# EAGLE schematic micromouse_board_revB_V0.0.3 (EAGLE 9.4.0)
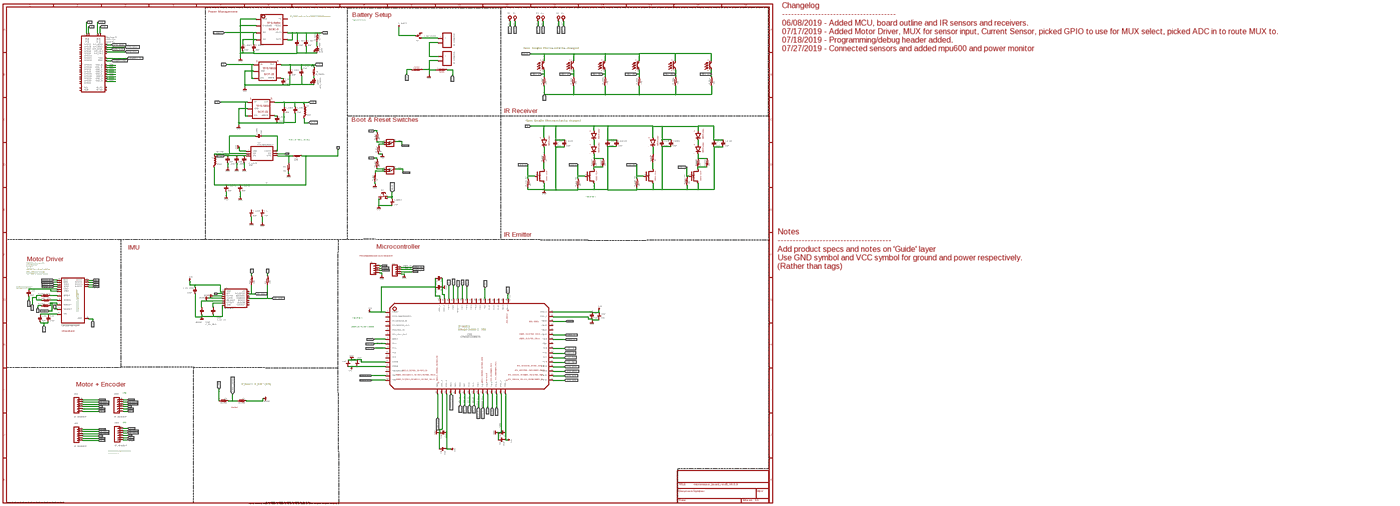
[diagram p0: schematic, sheet 1, overview]
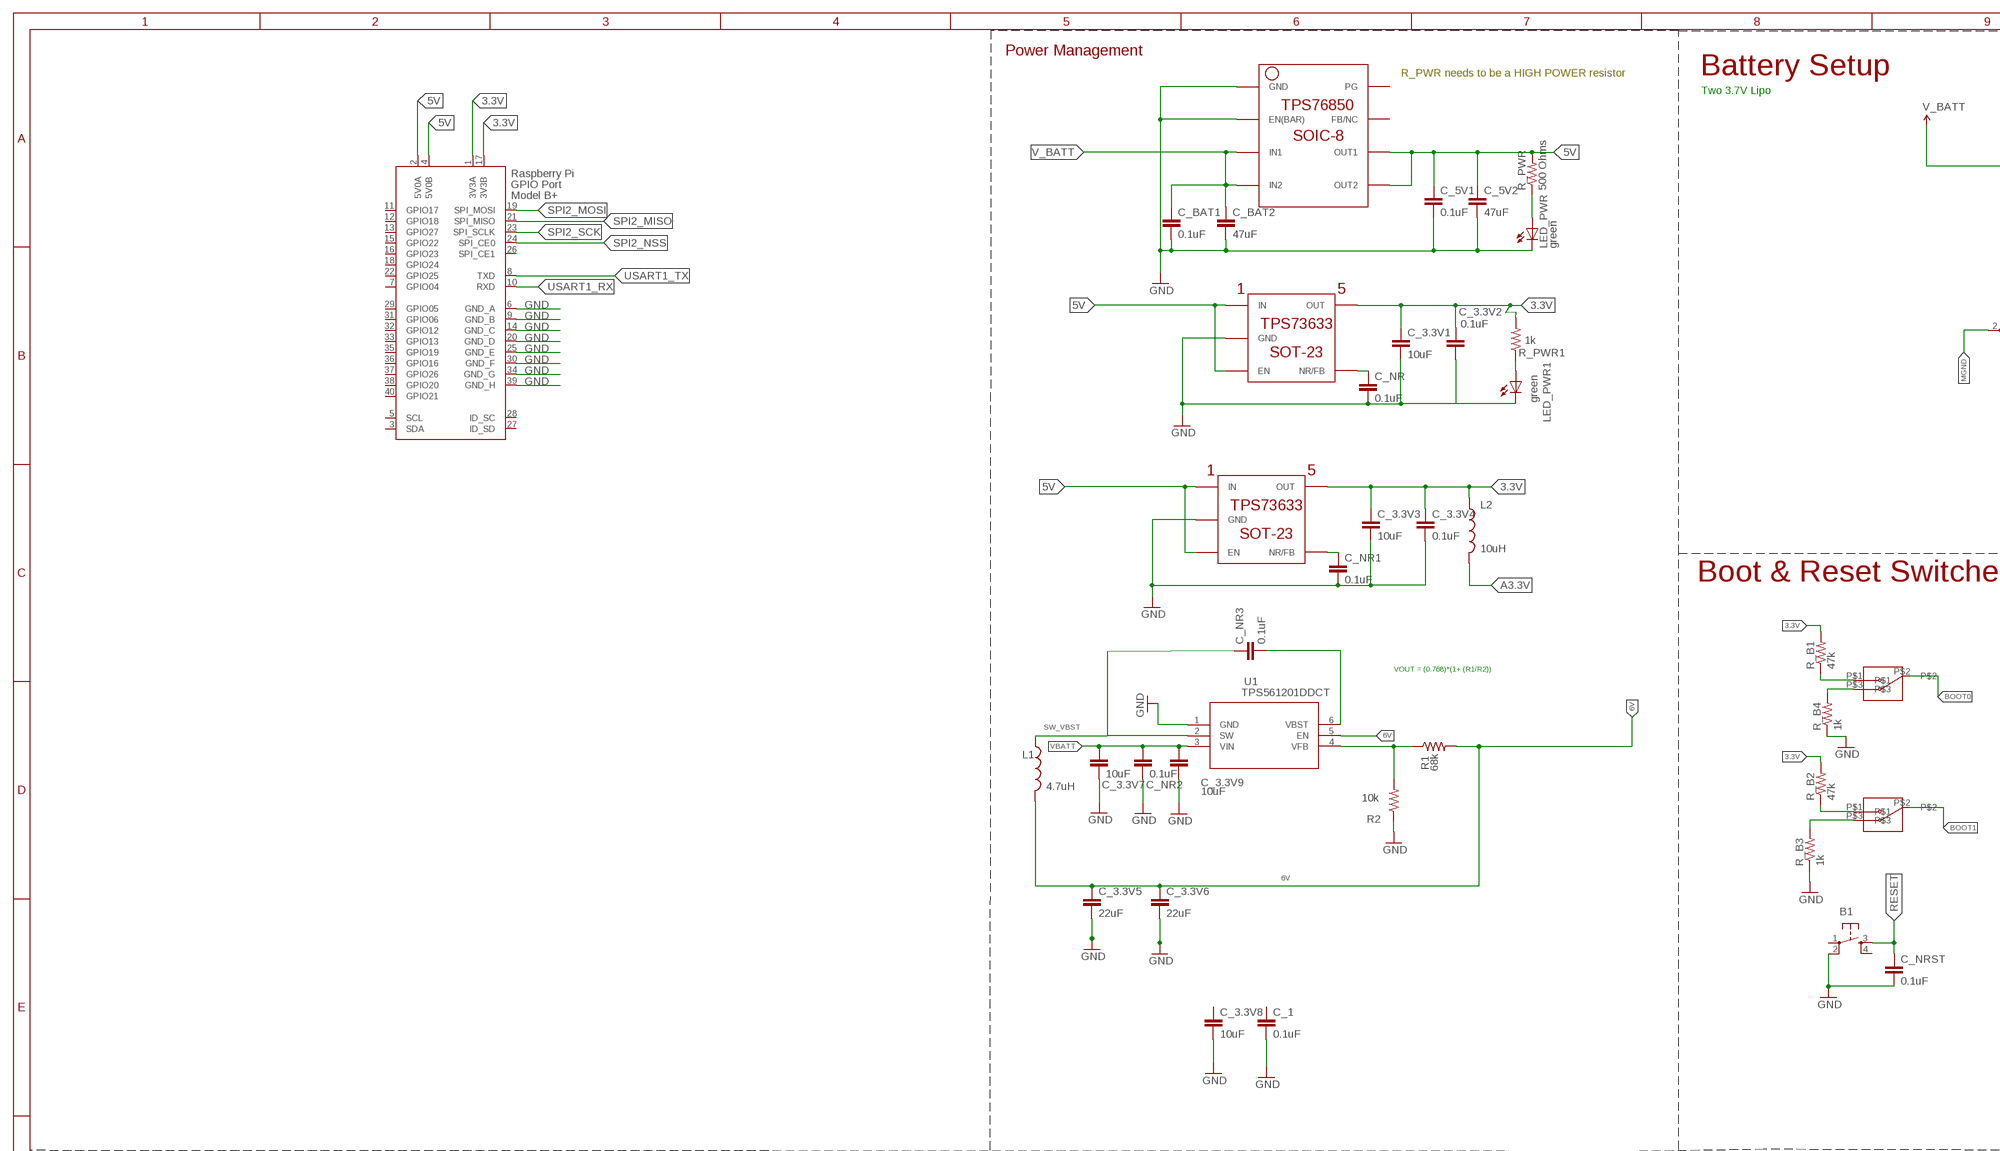
[diagram p1: schematic, sheet 1, part 1 of 6]
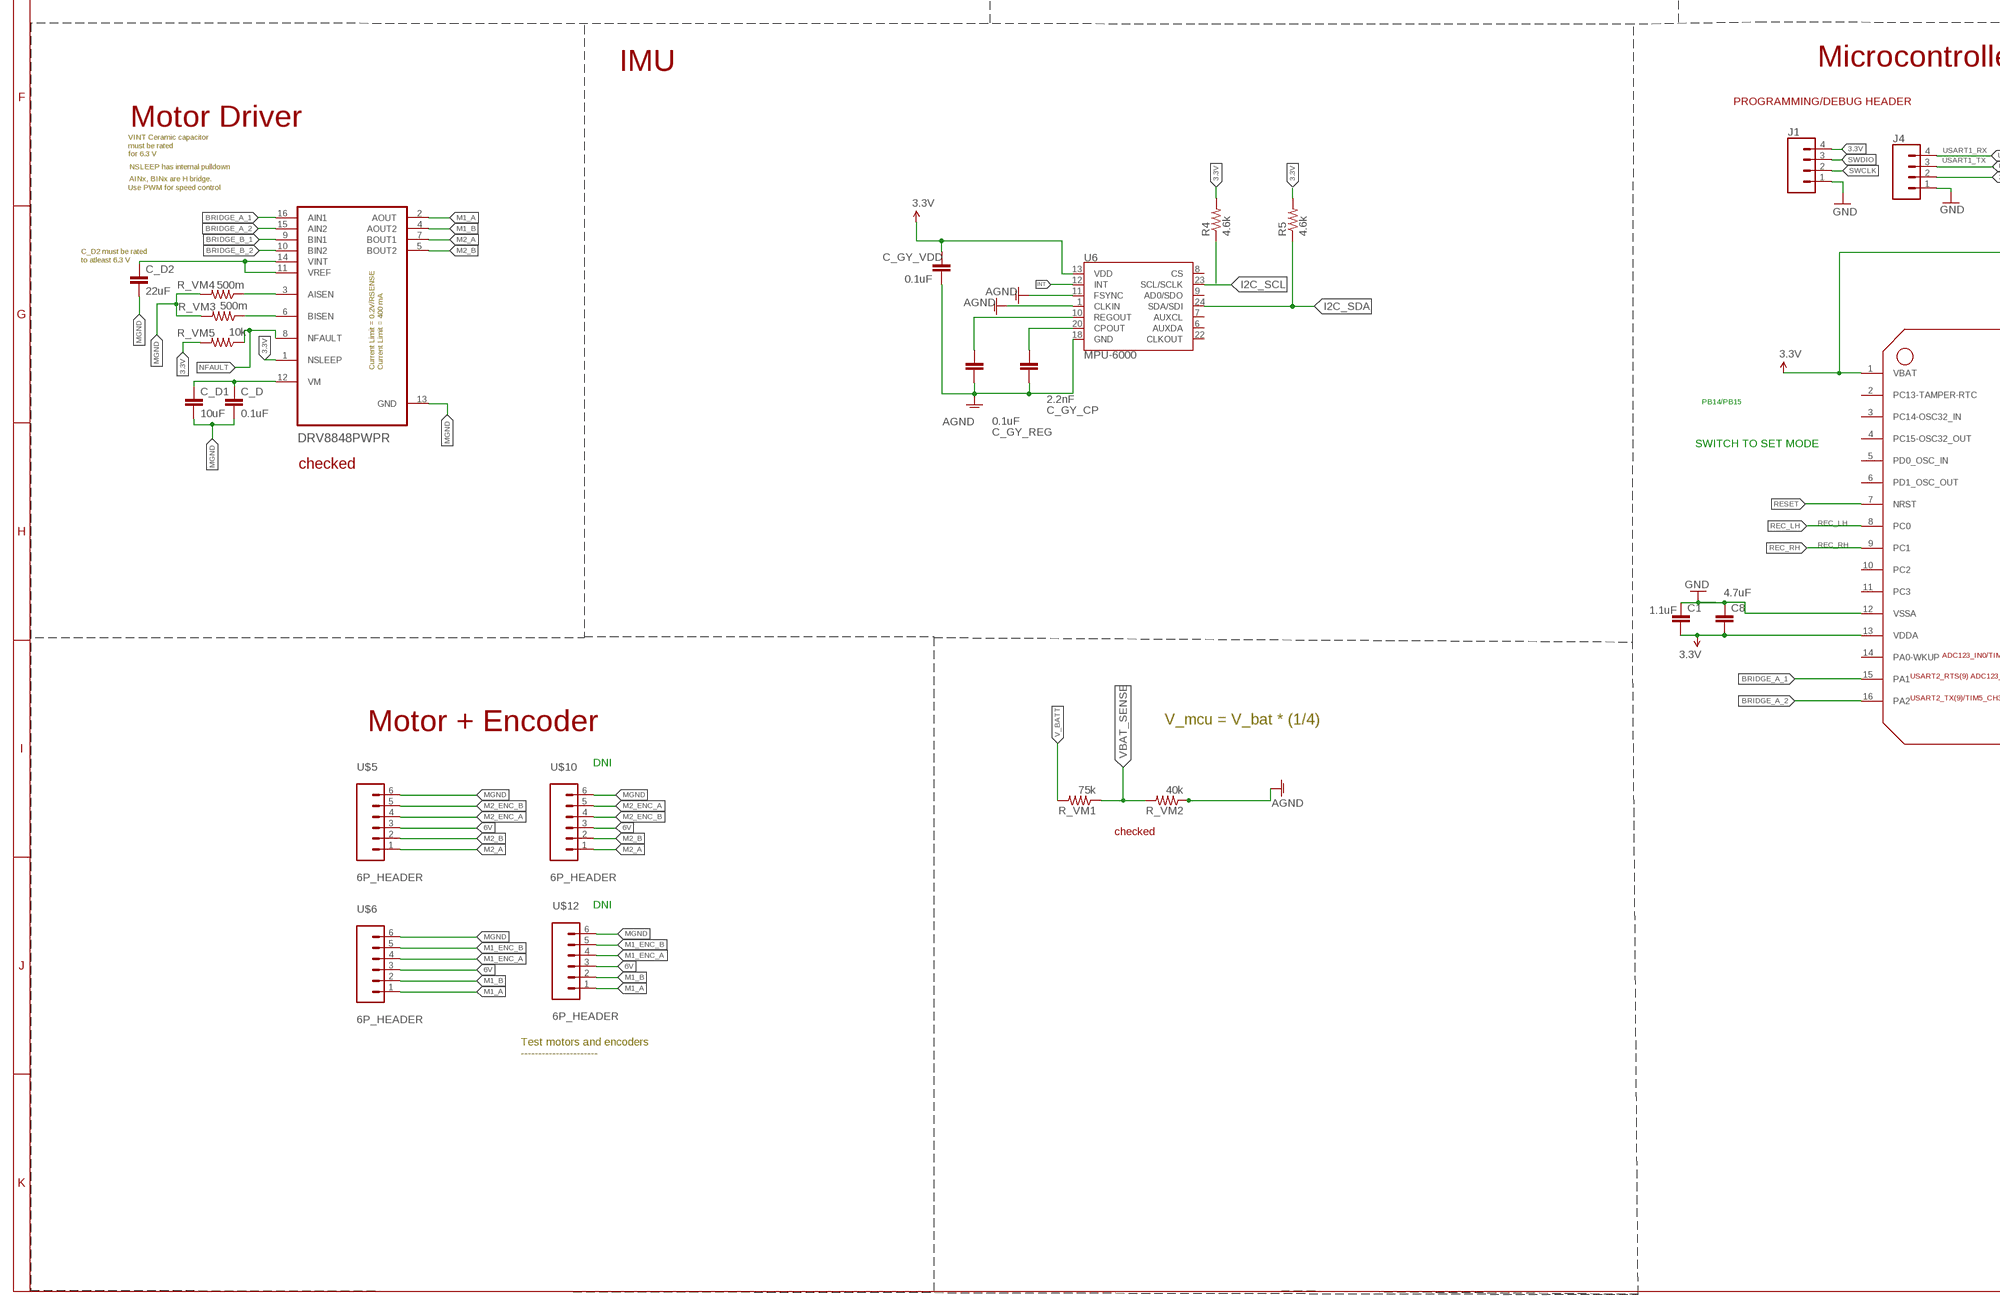
[diagram p2: schematic, sheet 1, part 2 of 6]
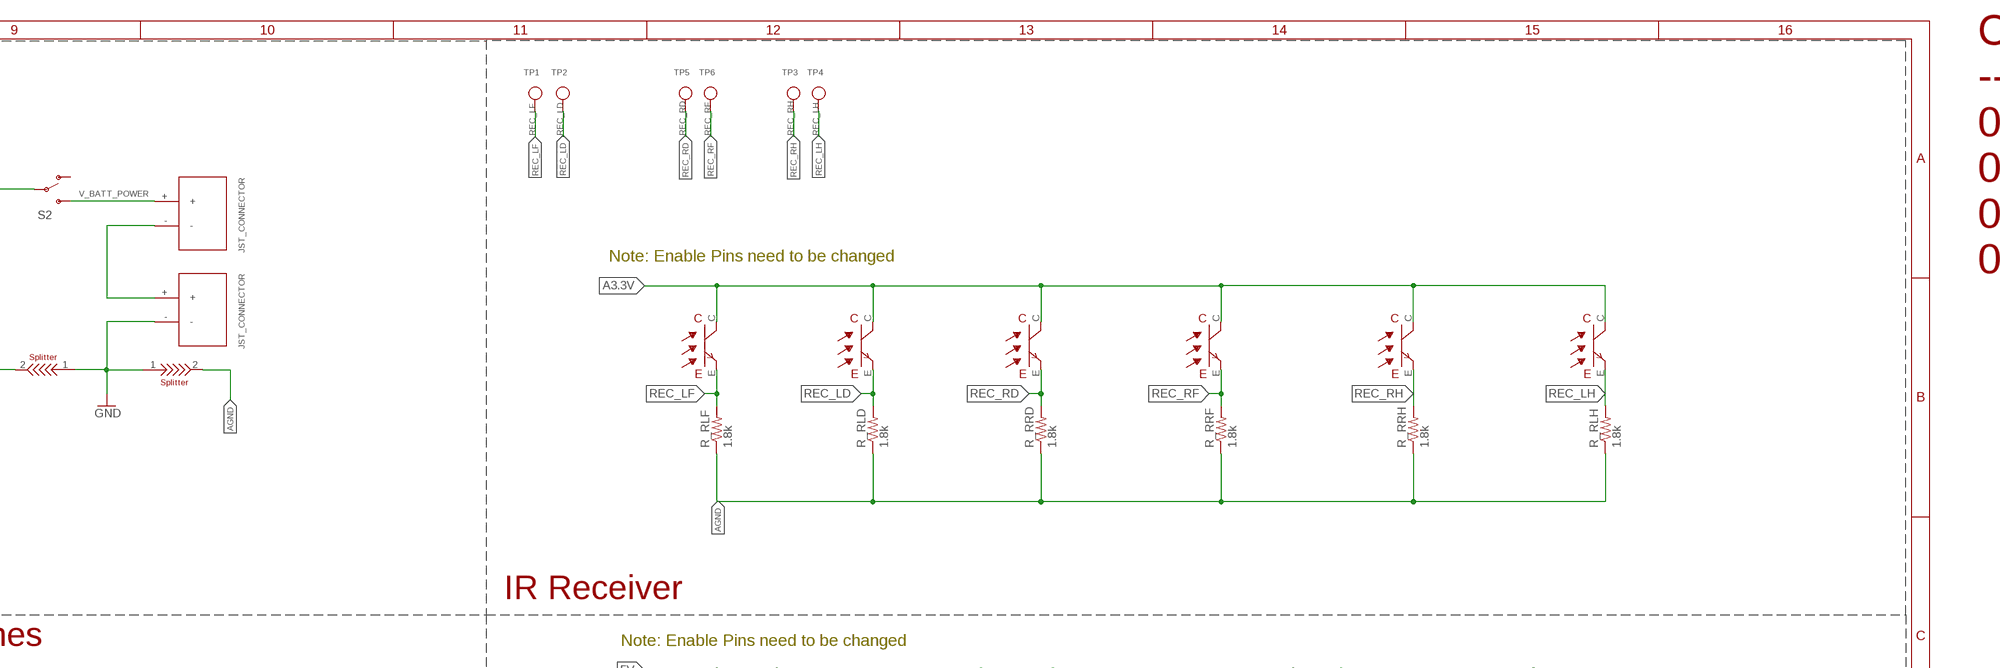
[diagram p3: schematic, sheet 1, part 3 of 6]
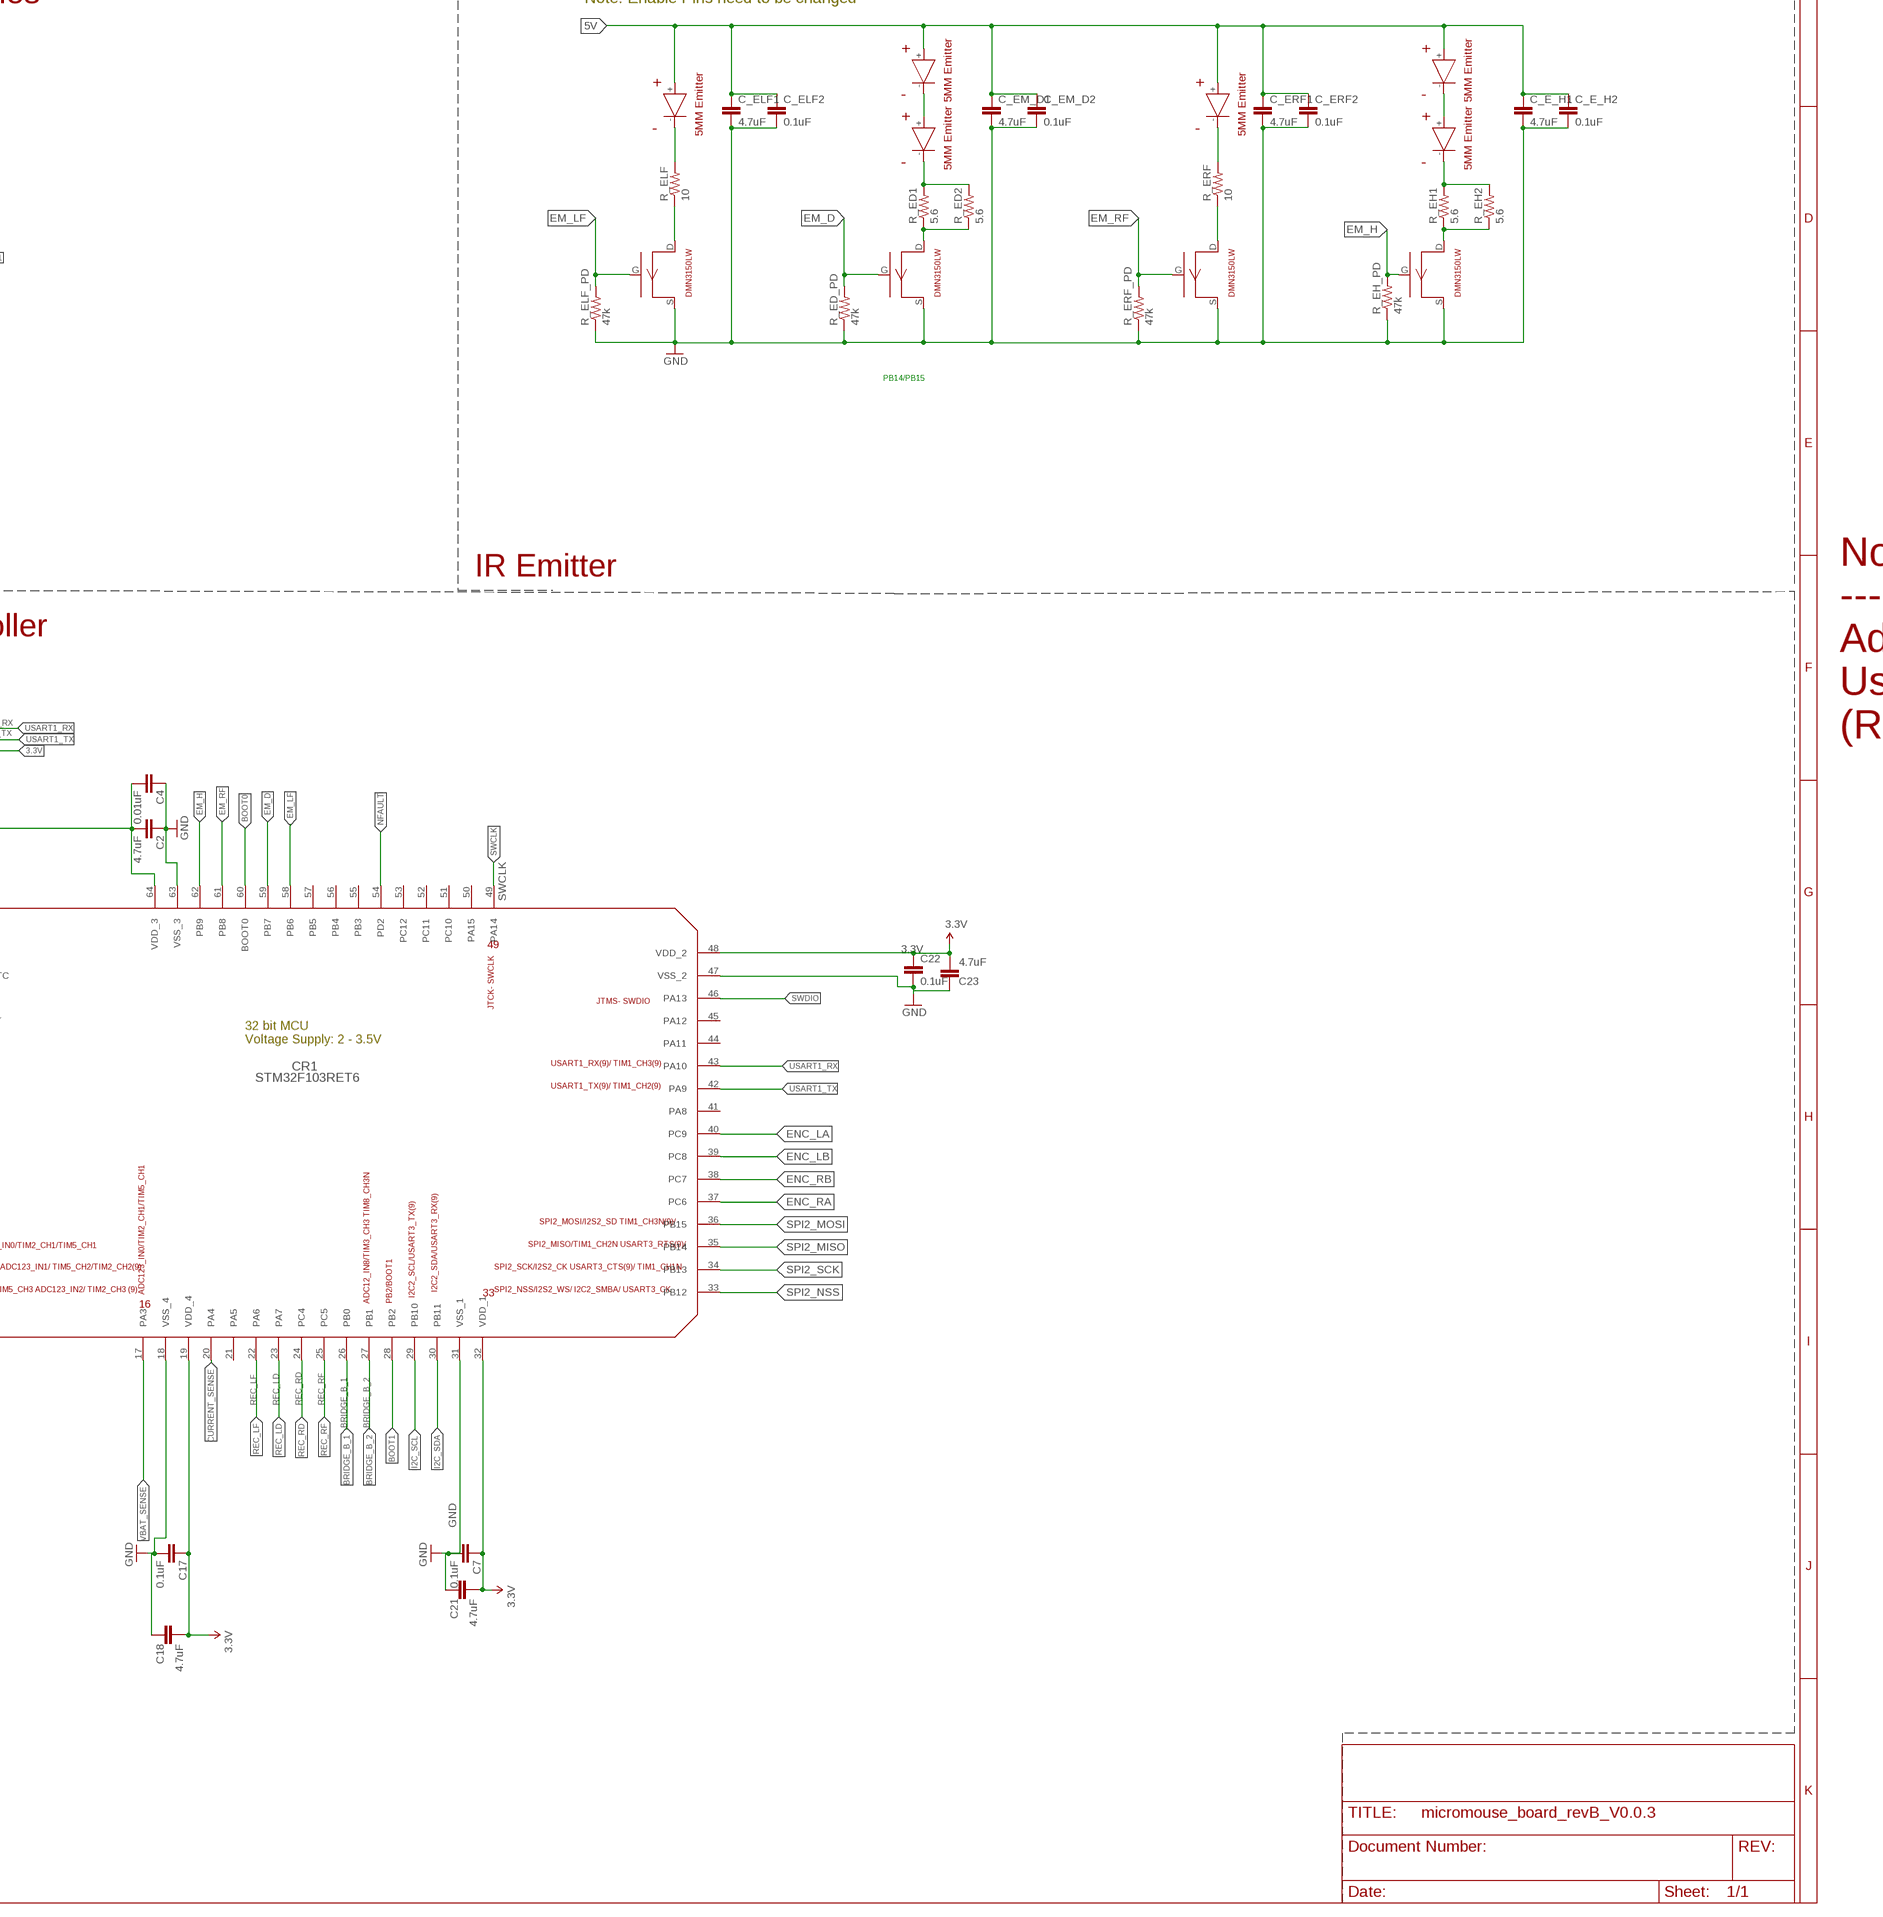
[diagram p4: schematic, sheet 1, part 4 of 6]
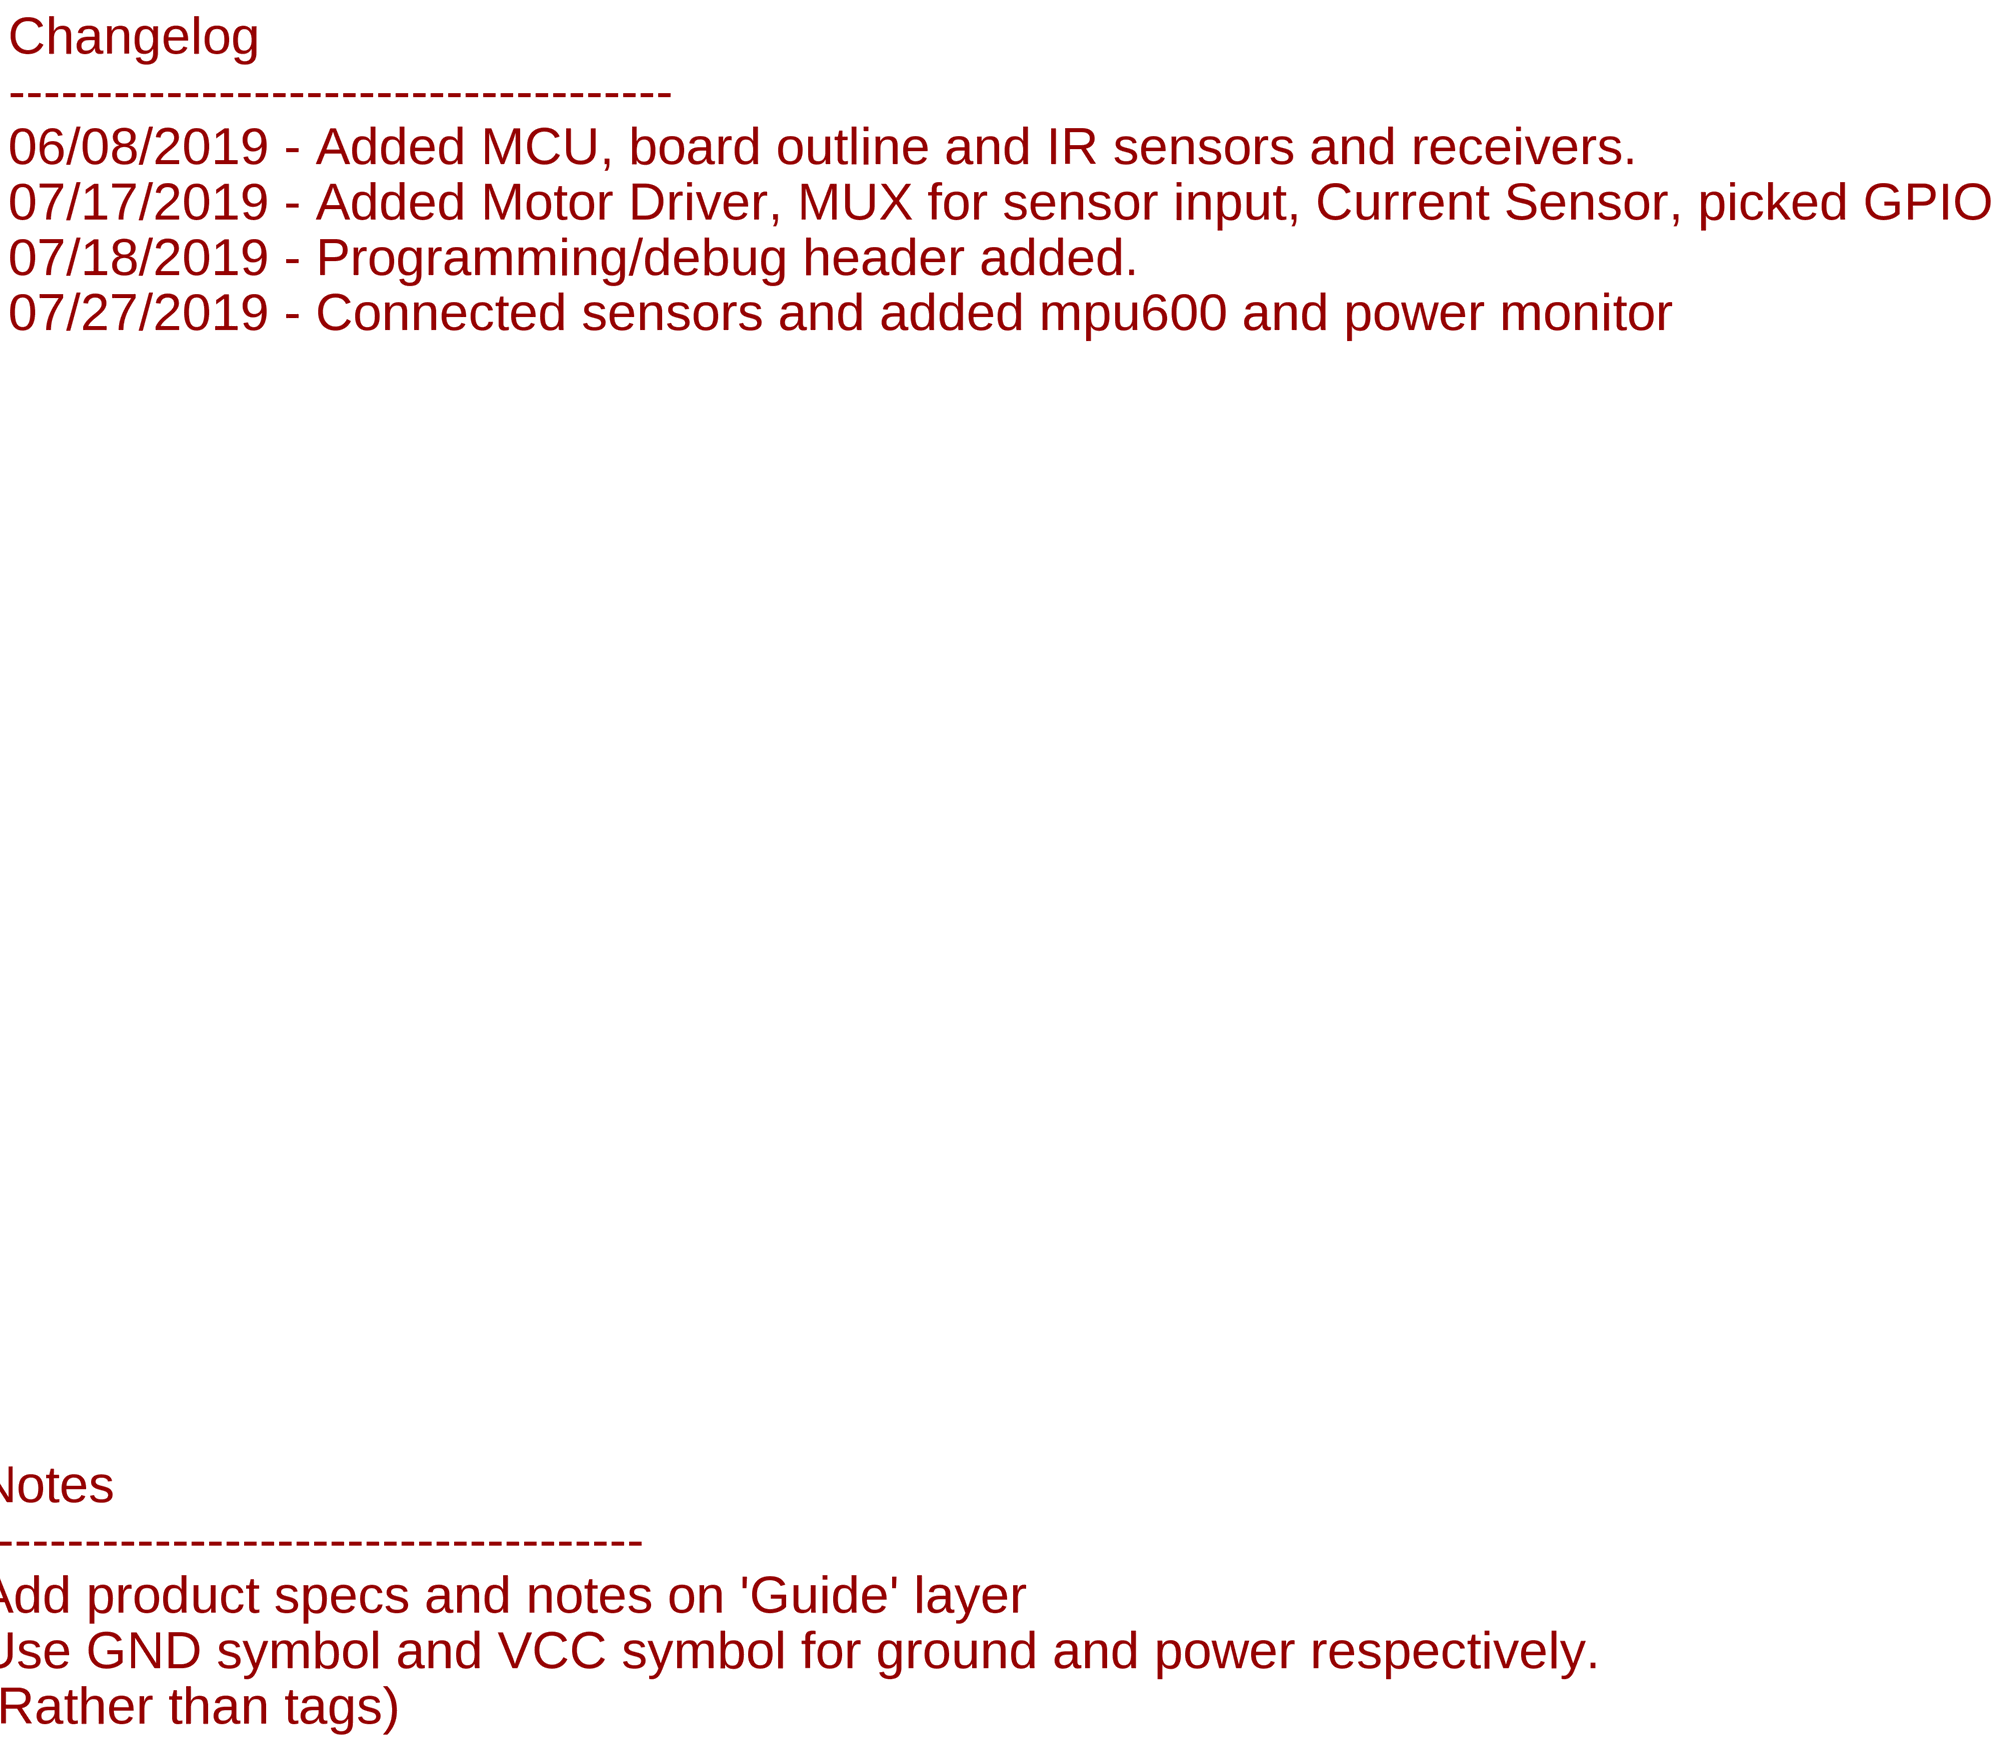
[diagram p5: schematic, sheet 1, part 5 of 6]
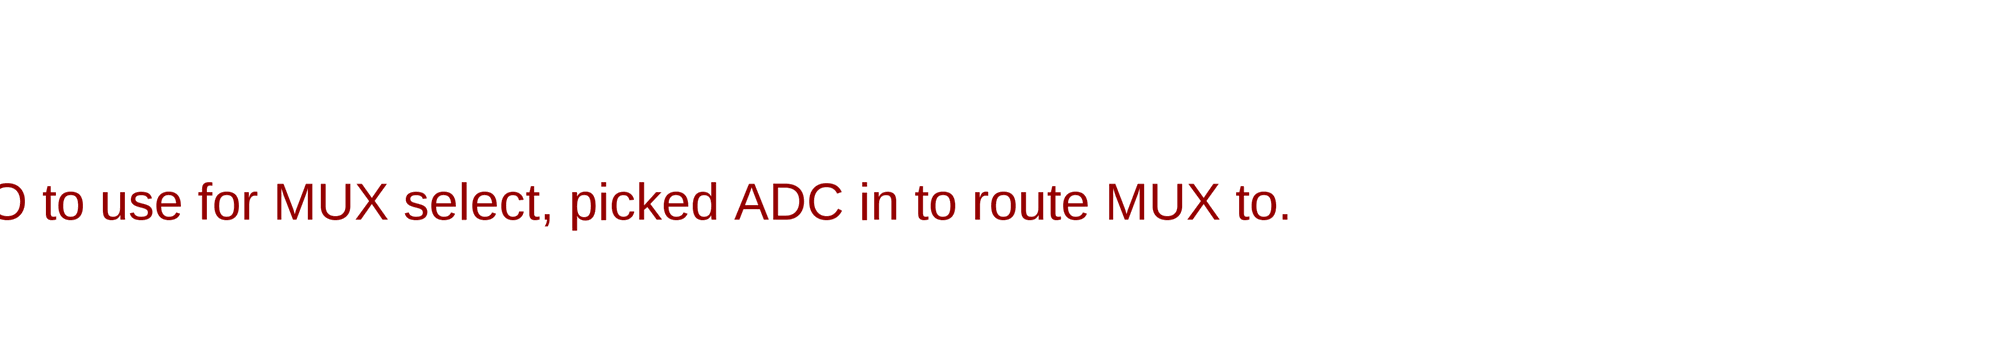
[diagram p6: schematic, sheet 1, part 6 of 6]

## Parts
B1  TAC_SWITCHSMD  [TACTILE-SWITCH-SMD]
C1  1.1uF  CAP0603-CAP  [0603-CAP]
C2  4.7uF  CAP0603-CAP  [0603-CAP]
C4  0.01uF  CAP0603-CAP  [0603-CAP]
C7  0.1uF  CAP0603-CAP  [0603-CAP]
C8  4.7uF  CAP0603-CAP  [0603-CAP]
C17  0.1uF  CAP0603-CAP  [0603-CAP]
C18  4.7uF  CAP0603-CAP  [0603-CAP]
C21  4.7uF  CAP0603-CAP  [0603-CAP]
C22  0.1uF  CAP0603-CAP  [0603-CAP]
C23  4.7uF  CAP0603-CAP  [0603-CAP]
C_1  0.1uF  CAP0603-CAP  [0603-CAP]
C_3.3V1  10uF  CAP0603-CAP  [0603-CAP]
C_3.3V2  0.1uF  CAP0603-CAP  [0603-CAP]
C_3.3V3  10uF  CAP0603-CAP  [0603-CAP]
C_3.3V4  0.1uF  CAP0603-CAP  [0603-CAP]
C_3.3V5  22uF  CAP0603-CAP  [0603-CAP]
C_3.3V6  22uF  CAP0603-CAP  [0603-CAP]
C_3.3V7  10uF  CAP0603-CAP  [0603-CAP]
C_3.3V8  10uF  CAP0603-CAP  [0603-CAP]
C_3.3V9  10uF  CAP0603-CAP  [0603-CAP]
C_5V1  0.1uF  CAP0603-CAP  [0603-CAP]
C_5V2  47uF  CAP1210  [1210]
C_BAT1  0.1uF  CAP0603-CAP  [0603-CAP]
C_BAT2  47uF  CAP1210  [1210]
C_D  0.1uF  CAP0603-CAP  [0603-CAP]
C_D1  10uF  CAP0603-CAP  [0603-CAP]
C_D2  22uF  CAP0603-CAP  [0603-CAP]
C_E_H1  4.7uF  CAP0603-CAP  [0603-CAP]
C_E_H2  0.1uF  CAP0603-CAP  [0603-CAP]
C_ELF1  4.7uF  CAP0603-CAP  [0603-CAP]
C_ELF2  0.1uF  CAP0603-CAP  [0603-CAP]
C_EM_D1  4.7uF  CAP0603-CAP  [0603-CAP]
C_EM_D2  0.1uF  CAP0603-CAP  [0603-CAP]
C_ERF1  4.7uF  CAP0603-CAP  [0603-CAP]
C_ERF2  0.1uF  CAP0603-CAP  [0603-CAP]
C_GY_CP  2.2nF  CAP0603-CAP  [0603-CAP]
C_GY_REG  0.1uF  CAP0603-CAP  [0603-CAP]
C_GY_VDD  0.1uF  CAP0603-CAP  [0603-CAP]
C_NR  0.1uF  CAP0603-CAP  [0603-CAP]
C_NR1  0.1uF  CAP0603-CAP  [0603-CAP]
C_NR2  0.1uF  CAP0603-CAP  [0603-CAP]
C_NR3  0.1uF  CAP0603-CAP  [0603-CAP]
C_NRST  0.1uF  CAP0603-CAP  [0603-CAP]
CR1  STM32F103RET6  [LQFP-64]
J1  CONN_04  [1X04]
J4  CONN_04  [1X04]
L1  4.7uH  INDUCTOR1007  [1007]
L2  10uH  INDUCTOR1007  [1007]
LED_PWR  green  LED1206  [LED-1206]
LED_PWR1  green  LED1206  [LED-1206]
LEFT_FRONT_EMITTER  EMITTER  [EMITTER]
NMOS1  DMN3150LW  [DMN3150LW]
NMOS2  DMN3150LW  [DMN3150LW]
NMOS3  DMN3150LW  [DMN3150LW]
NMOS4  DMN3150LW  [DMN3150LW]
R1  68k  RESISTOR0603-RES  [0603-RES]
R2  10k  RESISTOR0603-RES  [0603-RES]
R4  4.6k  R-US_M0805  [M0805]
R5  4.6k  R-US_M0805  [M0805]
R_B1  47k  RESISTOR0603-RES  [0603-RES]
R_B2  47k  RESISTOR0603-RES  [0603-RES]
R_B3  1k  RESISTOR0603-RES  [0603-RES]
R_B4  1k  RESISTOR0603-RES  [0603-RES]
R_ED1  5.6  RESISTOR0603-RES  [0603-RES]
R_ED2  5.6  RESISTOR0603-RES  [0603-RES]
R_ED_PD  47k  RESISTOR0603-RES  [0603-RES]
R_EH1  5.6  RESISTOR0603-RES  [0603-RES]
R_EH2  5.6  RESISTOR0603-RES  [0603-RES]
R_EH_PD  47k  RESISTOR0603-RES  [0603-RES]
R_ELF  10  RESISTOR0603-RES  [0603-RES]
R_ELF_PD  47k  RESISTOR0603-RES  [0603-RES]
R_ERF  10  RESISTOR0603-RES  [0603-RES]
R_ERF_PD  47k  RESISTOR0603-RES  [0603-RES]
R_PWR  500 Ohms  RESISTOR0603-RES  [0603-RES]
R_PWR1  1k  RESISTOR0603-RES  [0603-RES]
R_RLD  1.8k  RESISTOR0603-RES  [0603-RES]
R_RLF  1.8k  RESISTOR0603-RES  [0603-RES]
R_RLH  1.8k  RESISTOR0603-RES  [0603-RES]
R_RRD  1.8k  RESISTOR0603-RES  [0603-RES]
R_RRF  1.8k  RESISTOR0603-RES  [0603-RES]
R_RRH  1.8k  RESISTOR0603-RES  [0603-RES]
R_VM1  75k  RESISTOR0603-RES  [0603-RES]
R_VM2  40k  RESISTOR0603-RES  [0603-RES]
R_VM3  500m  RESISTOR0603-RES  [0603-RES]
R_VM4  500m  RESISTOR0603-RES  [0603-RES]
R_VM5  10k  RESISTOR0603-RES  [0603-RES]
REC_LF  RECEIVER  [RECEIVER]
S2  SWITCH-SPSTPTH  [SWITCH-SPDT]
TP1  TESTPOINTROUND2MM  [TESTPOINT_ROUND_2MM]
TP2  TESTPOINTROUND2MM  [TESTPOINT_ROUND_2MM]
TP3  TESTPOINTROUND2MM  [TESTPOINT_ROUND_2MM]
TP4  TESTPOINTROUND2MM  [TESTPOINT_ROUND_2MM]
TP5  TESTPOINTROUND2MM  [TESTPOINT_ROUND_2MM]
TP6  TESTPOINTROUND2MM  [TESTPOINT_ROUND_2MM]
U1  TPS561201DDCT  [DDC6]
U2  DRV8848PWPR  [SOP65P640X120-17N]
U6  MPU-6000  [QFN-24-EP]
U$1  JST_CONNECTOR_FEMALE  [JST_CONNECTOR_FEMALE]
U$2  JST_CONNECTOR_FEMALE  [JST_CONNECTOR_FEMALE]
U$3  TPS73633(SOT-23)  [TPS73633(SOT-23)]
U$4  TPS76850(SOIC-8)  [TPS76850(SOIC-8)]
U$5  6P_HEADER  [6P_HEADER]
U$6  6P_HEADER  [6P_HEADER]
U$7  RECEIVER  [RECEIVER]
U$8  RECEIVER  [RECEIVER]
U$9  RECEIVER  [RECEIVER]
U$10  6P_HEADER  [6P_HEADER]
U$11  EMITTER  [EMITTER]
U$12  6P_HEADER  [6P_HEADER]
U$13  EMITTER  [EMITTER]
U$14  SPARKFUN-SPDT  [SPDT]
U$15  SPARKFUN-SPDT  [SPDT]
U$16  SPLITTER  [SPLITTER]
U$17  EMITTER  [EMITTER]
U$18  EMITTER  [EMITTER]
U$19  EMITTER  [EMITTER]
U$20  RECEIVER  [RECEIVER]
U$21  RECEIVER  [RECEIVER]
U$22  SPLITTER  [SPLITTER]
U$23  TPS73633(SOT-23)  [TPS73633(SOT-23)]
X1  RASPI_GPIO_B+#_PIN  [RASPI_GPIO_B+_PIN]

## Nets
3.3V: C1.2 C2.2 C4.2 C7.1 C8.2 C17.1 C18.2 C21.2 C22.1 C23.2 C_3.3V1.1 C_3.3V2.1 C_3.3V3.1 C_3.3V4.1 C_GY_VDD.1 CR1.1(VBAT) CR1.13(VDDA) CR1.19(VDD_4) CR1.32(VDD_1) CR1.48(VDD_2) CR1.64(VDD_3) J1.4 J4.2 L2.1 R4.2 R5.2 R_B1.2 R_B2.2 R_PWR1.2 R_VM5.2 U2.1(NSLEEP) U6.13(VDD) U$3.OUT U$23.OUT X1.1(3V3A) X1.17(3V3B)
5V: C_5V1.1 C_5V2.1 C_E_H1.1 C_E_H2.1 C_ELF1.1 C_ELF2.1 C_EM_D1.1 C_EM_D2.1 C_ERF1.1 C_ERF2.1 LEFT_FRONT_EMITTER.+ R_PWR.2 U$3.EN U$3.IN U$4.OUT1 U$4.OUT2 U$11.+ U$13.+ U$18.+ U$23.EN U$23.IN X1.2(5V0A) X1.4(5V0B)
6V: C_3.3V5.1 C_3.3V6.1 L1.2 R1.2 U1.5(EN) U$5.3 U$6.3 U$10.3 U$12.3
A3.3V: L2.2 REC_LF.C U$7.C U$8.C U$9.C U$20.C U$21.C
AGND: C_GY_CP.2 C_GY_REG.2 C_GY_VDD.2 R_RLD.1 R_RLF.1 R_RLH.1 R_RRD.1 R_RRF.1 R_RRH.1 R_VM2.1 U6.1(CLKIN) U6.11(FSYNC) U6.18(GND) U$22.2
BATT_CONN: U$1.+ U$2.-
BOOT0: CR1.60(BOOT0) U$14.P$2
BOOT1: CR1.28(PB2) U$15.P$2
BRIDGE_A_1: CR1.15(PA1) U2.16(AIN1)
BRIDGE_A_2: CR1.16(PA2) U2.15(AIN2)
BRIDGE_B_1: CR1.26(PB0) U2.9(BIN1)
BRIDGE_B_2: CR1.27(PB1) U2.10(BIN2)
CURRENT_SENSE: CR1.20(PA4)
D2_EM: R_ED1.2 R_ED2.2 U$17.-
D_EM: U$11.- U$17.+
EM_D: CR1.59(PB7) NMOS2.G R_ED_PD.2
EM_H: CR1.62(PB9) NMOS4.G R_EH_PD.2
EM_LF: CR1.58(PB6) NMOS1.G R_ELF_PD.2
EM_RF: CR1.61(PB8) NMOS3.G R_ERF_PD.2
ENC_LA: CR1.40(PC9)
ENC_LB: CR1.39(PC8)
ENC_RA: CR1.37(PC6)
ENC_RB: CR1.38(PC7)
GND: B1.2 C1.1 C2.1 C4.1 C7.2 C8.1 C17.2 C18.1 C21.1 C22.2 C23.1 C_1.2 C_3.3V1.2 C_3.3V2.2 C_3.3V3.2 C_3.3V4.2 C_3.3V5.2 C_3.3V6.2 C_3.3V7.2 C_3.3V8.2 C_3.3V9.2 C_5V1.2 C_5V2.2 C_BAT1.2 C_BAT2.2 C_E_H1.2 C_E_H2.2 C_ELF1.2 C_ELF2.2 C_EM_D1.2 C_EM_D2.2 C_ERF1.2 C_ERF2.2 C_NR1.2 C_NR2.2 C_NR.2 C_NRST.2 CR1.12(VSSA) CR1.18(VSS_4) CR1.31(VSS_1) CR1.47(VSS_2) CR1.63(VSS_3) J1.1 J4.1 LED_PWR1.C LED_PWR.C NMOS1.S NMOS2.S NMOS3.S NMOS4.S R2.1 R_B3.1 R_B4.1 R_ED_PD.1 R_EH_PD.1 R_ELF_PD.1 R_ERF_PD.1 U1.1(GND) U$1.- U$3.GND U$4.EN(BAR) U$4.GND U$16.1 U$22.1 U$23.GND X1.6(GND_A) X1.9(GND_B) X1.14(GND_C) X1.20(GND_D) X1.25(GND_E) X1.30(GND_F) X1.34(GND_G) X1.39(GND_H)
H2_EM: R_EH1.2 R_EH2.2 U$19.-
H_EM: U$18.- U$19.+
I2C_SCL: CR1.29(PB10) U6.23(SCL/SCLK)
I2C_SDA: CR1.30(PB11) R5.1 U6.24(SDA/SDI)
INT: U6.12(INT)
LF_EM: LEFT_FRONT_EMITTER.- R_ELF.2
M1_A: U2.2(AOUT) U$6.1 U$12.1
M1_B: U2.4(AOUT2) U$6.2 U$12.2
M1_ENC_A: U$6.4 U$12.4
M1_ENC_B: U$6.5 U$12.5
M2_A: U2.7(BOUT1) U$5.1 U$10.1
M2_B: U2.5(BOUT2) U$5.2 U$10.2
M2_ENC_A: U$5.4 U$10.5
M2_ENC_B: U$5.5 U$10.4
MGND: C_D1.2 C_D2.2 C_D.2 R_VM3.2 R_VM4.2 U2.13(GND) U$5.6 U$6.6 U$10.6 U$12.6 U$16.2
N$1: C_NR1.1 U$23.NR/FB
N$2: R_VM4.1 U2.3(AISEN)
N$3: R4.1
N$4: R_B2.1 U$15.P$1
N$5: NMOS3.D R_ERF.1
N$6: R_B1.1 U$14.P$1
N$7: NMOS1.D R_ELF.1
N$8: R_VM3.1 U2.6(BISEN)
N$9: LED_PWR1.A R_PWR1.1
N$10: C_D1.1 C_D.1 U2.12(VM)
N$11: C_D2.1 U2.11(VREF) U2.14(VINT)
N$12: R_B3.2 U$15.P$3
N$13: R_B4.2 U$14.P$3
N$14: R1.1 R2.2 U1.4(VFB)
N$15: C_NR3.2 U1.6(VBST)
N$18: NMOS2.D R_ED1.1 R_ED2.1
N$19: NMOS4.D R_EH1.1 R_EH2.1
N$26: C_NR.1 U$3.NR/FB
N$27: LED_PWR.A R_PWR.1
N$28: C_GY_REG.1 U6.10(REGOUT)
N$29: C_GY_CP.1 U6.20(CPOUT)
NFAULT: CR1.54(PD2) R_VM5.1 U2.8(NFAULT)
REC_LD: CR1.23(PA7) R_RLD.2 TP2.P$1 U$7.E
REC_LF: CR1.22(PA6) R_RLF.2 REC_LF.E TP1.P$1
REC_LH: CR1.8(PC0) R_RLH.2 TP4.P$1 U$21.E
REC_RD: CR1.24(PC4) R_RRD.2 TP5.P$1 U$8.E
REC_RF: CR1.25(PC5) R_RRF.2 TP6.P$1 U$9.E
REC_RH: CR1.9(PC1) R_RRH.2 TP3.P$1 U$20.E
RESET: B1.3 C_NRST.1 CR1.7(NRST)
RF_EM: R_ERF.2 U$13.-
SPI2_MISO: CR1.35(PB14) X1.21(SPI_MISO)
SPI2_MOSI: CR1.36(PB15) X1.19(SPI_MOSI)
SPI2_NSS: CR1.33(PB12) X1.24(SPI_CE0)
SPI2_SCK: CR1.34(PB13) X1.23(SPI_SCLK)
SW_VBST: C_NR3.1 L1.1 U1.2(SW)
SWCLK: CR1.49(PA14) J1.2
SWDIO: CR1.46(PA13) J1.3
USART1_RX: CR1.43(PA10) J4.4 X1.10(RXD)
USART1_TX: CR1.42(PA9) J4.3 X1.8(TXD)
V_BATT: C_BAT1.1 C_BAT2.1 R_VM1.2 S2.2(P) U$4.IN1 U$4.IN2
V_BATT_POWER: S2.3(S) U$2.+
VBAT_SENSE: CR1.17(PA3) R_VM1.1 R_VM2.2
VBATT: C_3.3V7.1 C_3.3V9.1 C_NR2.1 U1.3(VIN)
Unconnected: B1.1 B1.4 C_1.1 C_3.3V8.1 CR1.2(PC13-TAMPER-RTC) CR1.3(PC14-OSC32_IN) CR1.4(PC15-OSC32_OUT) CR1.5(PD0_OSC_IN) CR1.6(PD1_OSC_OUT) CR1.10(PC2) CR1.11(PC3) CR1.14(PA0-WKUP) CR1.21(PA5) CR1.41(PA8) CR1.44(PA11) CR1.45(PA12) CR1.50(PA15) CR1.51(PC10) CR1.52(PC11) CR1.53(PC12) CR1.55(PB3) CR1.56(PB4) CR1.57(PB5) S2.1(O) U6.6(AUXDA) U6.7(AUXCL) U6.8(CS) U6.9(AD0/SDO) U6.22(CLKOUT) U$4.FB/NC U$4.PG X1.3(SDA) X1.5(SCL) X1.7(GPIO04) X1.11(GPIO17) X1.12(GPIO18) X1.13(GPIO27) X1.15(GPIO22) X1.16(GPIO23) X1.18(GPIO24) X1.22(GPIO25) X1.26(SPI_CE1) X1.27(ID_SD) X1.28(ID_SC) X1.29(GPIO05) X1.31(GPIO06) X1.32(GPIO12) X1.33(GPIO13) X1.35(GPIO19) X1.36(GPIO16) X1.37(GPIO26) X1.38(GPIO20) X1.40(GPIO21)

## Notes on the sheet
- Power Management
- R_PWR needs to be a HIGH POWER resistor | Battery Setup
- Two 3.7V Lipo
- Note: Enable Pins need to be changed
- Changelog
  --------------------------------------
  06/08/2019 - Added MCU, board outline and IR sensors and receivers.                                      
  07/17/2019 - Added Motor Driver, MUX for sensor input, Current Sensor, picked GPIO to use for MUX select, picked ADC in to route MUX to. 
  07/18/2019 - Programming/debug header added.
  07/27/2019 - Connected sensors and added mpu600 and power monitor
- IR Receiver
- Boot & Reset Switches | Note: Enable Pins need to be changed
- VOUT = (0.768)*(1+ (R1/R2))
- PB14/PB15
- IR Emitter
- IMU | Microcontroller
- PROGRAMMING/DEBUG HEADER
- Motor Driver
- VINT Ceramic capacitor 
  must be rated 
  for 6.3 V
- Notes
  --------------------------------------
  Add product specs and notes on 'Guide' layer
  Use GND symbol and VCC symbol for ground and power respectively.
  (Rather than tags)
- NSLEEP has internal pulldown
- AINx, BINx are H bridge.
- Use PWM for speed control
- C_D2 must be rated
  to atleast 6.3 V
- Current Limit = 0.2V/RSENSE
  Current Limit = 400 mA
- PB14/PB15
- JTMS- SWDIO
- JTCK- SWCLK
- SWITCH TO SET MODE
- 32 bit MCU
  Voltage Supply: 2 - 3.5V
- checked
- USART1_RX(9)/ TIM1_CH3(9)
- USART1_TX(9)/ TIM1_CH2(9)
- SPI2_MOSI/I2S2_SD TIM1_CH3N(9)/
- ADC123_IN0/TIM2_CH1/TIM5_CH1 | SPI2_MISO/TIM1_CH2N USART3_RTS(9)/
- USART2_RTS(9) ADC123_IN1/ TIM5_CH2/TIM2_CH2(9) | SPI2_SCK/I2S2_CK USART3_CTS(9)/ TIM1_CH1N
- USART2_TX(9)/TIM5_CH3 ADC123_IN2/ TIM2_CH3 (9) | ADC123_IN0/TIM2_CH1/TIM5_CH1 | I2C2_SDA/USART3_RX(9) | SPI2_NSS/I2S2_WS/ I2C2_SMBA/ USART3_CK
- I2C2_SCL/USART3_TX(9)
- ADC12_IN8/TIM3_CH3 TIM8_CH3N | PB2/BOOT1
- V_mcu = V_bat * (1/4)
- Motor + Encoder
- DNI
- checked
- DNI
- Test motors and encoders
  ----------------------

## Library data of the parts
B1 = SparkFun-Retired:TAC_SWITCH: Momentary Switch Button commonly used for reset or general input. Spark Fun Electronics SKU : COM-00097 SMT- SWCH-08247; PROD_ID: SWCH-08247; VALUE: TAC_SWITCHSMD
C1 C2 C4 C7 C8 C17 C18 C21-C23 C_1 C_3.3V1-C_3.3V9 C_5V1 C_5V2 C_BAT1 C_BAT2 C_D C_D1 C_D2 C_E_H1 C_E_H2 C_ELF1 C_ELF2 C_EM_D1 C_EM_D2 C_ERF1 C_ERF2 C_GY_CP C_GY_REG C_GY_VDD C_NR C_NR1-C_NR3 = micromouse-board-added-piconnector:CAP: Capacitor Standard 0603 ceramic capacitor, and 0.1" leaded capacitor.
C_NRST = SparkFun:CAP: Capacitor Standard 0603 ceramic capacitor, and 0.1" leaded capacitor.
CR1 = micromouse-board-added-piconnector:STM32F103RET6; MANUFACTURER_PART_NUMBER: STM32F103RET6; VENDOR: STMicroelectronics
J1 J4 = micromouse-board-added-piconnector:CONN_04: Multi connection point. Often used as Generic Header-pin footprint for 0.1 inch spaced/style header connections On any of the 0.1 inch spaced packages, you can populate with these: Break Away Headers - Straight <https://www.sparkfun.com/products/116> (PRT-00116) Break Away Male Headers - Right Angle <https://www.sparkfun.com/products/553> (PRT-00553) Female Headers <https://www.sparkfun.com/products/115> (PRT-00115) Break Away Headers - Machine Pin <https://www.sparkfun.com/products/117> (PRT-00117) Break Away Female Headers - Swiss Machine Pin <https://www.sparkfun.com/products/743> (PRT-00743) For SCREWTERMINALS and SPRING TERMINALS visit here: Screw Terimnals on SparkFun.com <https://www.sparkfun.com/search/results?term=Screw+Terminals> (5mm/3.5mm/2.54mm spacing) This device is also useful as a general connection point to wire up your design to another part of your project. Our various solder wires solder well into these plated through hole pads. Hook-Up Wire - Assortment (Stranded, 22 AWG) <https://www.sparkfun.com/products/11375> (PRT-11375) Hook-Up Wire - Assortment (Solid Core, 22 AWG) <https://www.sparkfun.com/products/11367> (PRT-11367) View the entire wire category on our website here <https://www.sparkfun.com/categories/141> Special notes: Molex polarized connector foot print use with SKU : PRT-08231 with associated crimp pins and housings. 1MM SMD Version SKU: PRT-10208; PROD_ID: CONN-09696
L1 L2 = micromouse-board-added-piconnector:INDUCTOR: Inductors Basic Inductor/Choke - 0603 and 1206. Footprints are not proven and vary greatly between part numbers. INDUCTOR POWER 3.3UH 4.0A SMD 0.197" L x 0.197" W x 0.177" H (5.00mm x 5.00mm x 4.50mm)
LED_PWR LED_PWR1 = micromouse-board-added-piconnector:LED: LEDs Standard schematic elements and footprints for 5mm, 3mm, 1206, and 0603 sized LEDs. 5mm - Spark Fun Electronics SKU : COM-00529 (and others)
LEFT_FRONT_EMITTER U$11 U$13 U$17-U$19 = micromouse-board-added-piconnector:EMITTER
NMOS1-NMOS4 = micromouse-board-added-piconnector:DMN3150LW
R1 R2 R_ED1 R_ED2 R_ED_PD R_EH1 R_EH2 R_EH_PD R_ELF R_ELF_PD R_ERF R_ERF_PD R_PWR R_PWR1 R_RLD R_RLF R_RLH R_RRD R_RRF R_RRH R_VM1-R_VM5 = micromouse-board-added-piconnector:RESISTOR: Resistor Basic schematic elements and footprints for 0603, 1206, and PTH resistors.
R4 R5 = rcl:R-US_: RESISTOR, American symbol; SPICEPREFIX: R
R_B1-R_B4 = SparkFun-Passives:RESISTOR: Resistor Basic schematic elements and footprints for 0603, 1206, and PTH resistors.
REC_LF U$7-U$9 U$20 U$21 = micromouse-board-added-piconnector:RECEIVER
S2 = micromouse-board-added-piconnector:SWITCH-SPST: SPST Switch Simple slide switch. Spark Fun Electronics SKU : COM-00102
TP1-TP6 = micromouse-board-added-piconnector:TESTPOINT: Test Point Various test points for characterisation and PCB testing TESTPOINT_SMT - Compact Surface Mount Test Point [Digikey: 5016KTR-ND]
U1 = micromouse-board-added-piconnector:TPS561201DDCT; BUILT_BY: EMA_Molly; COPYRIGHT: Copyright (C) 2018 Accelerated Designs. All rights reserved; MANUFACTURER_PART_NUMBER: TPS561201DDCT; VENDOR: Texas Instruments
U2 = micromouse-board-added-piconnector:DRV8848PWPR: None; AVAILABILITY: Unavailable; DESCRIPTION: 2A Dual H-Bridge Motor Driver _PWM Control_ 16-HTSSOP -40 to 85; MF: Texas Instruments; MP: DRV8848PWPR; PACKAGE: HTSSOP-16 Texas Instruments; PRICE: None
U6 = micromouse-board-added-piconnector:MPU-6000: Invensense MPU-6000 6-Axis Gryoscope/Accelerometer 3-axis gyroscope, 3-axis accelerometer in a 4x4 package. The MPU-6000 is the world’s first 6-axis I²C MotionTracking device designed for the low power, low cost, and high performance requirements of smartphones, tablets and wearable sensors. Datasheet <http://cdn.sparkfun.com/datasheets/Components/General%20IC/PS-MPU-6000A.pdf> SparkFun Products MPU-6000 - Motion Processing Unit <https://www.sparkfun.com/products/11234> (SEN-11234) SparkFun UDB5 - PIC UAV Development Board <https://www.sparkfun.com/products/11703> (GPS-11703); PROD_ID: IC-11089; SF_ID: SEN-11234
U$1 U$2 = micromouse-board-added-piconnector:JST_CONNECTOR_FEMALE
U$3 U$23 = micromouse-board-added-piconnector:TPS73633(SOT-23)
U$4 = micromouse-board-added-piconnector:TPS76850(SOIC-8)
U$5 U$6 U$10 U$12 = micro-motor:6P_HEADER: Generic 6P header
U$14 U$15 = micro-motor:SPARKFUN-SPDT
U$16 U$22 = splitter:SPLITTER
X1 = raspberrypi_bastelstube_v13:RASPI_GPIO_B+#: 2x20 header connector, all pins connected

## Net classes
0 default: width 0.254 mm, drill 0.178 mm, clearance 0.178 mm